# Altium schematic sheet AudioBoard.SchDoc
size A4; SheetNumber: 1; SheetTotal: 1
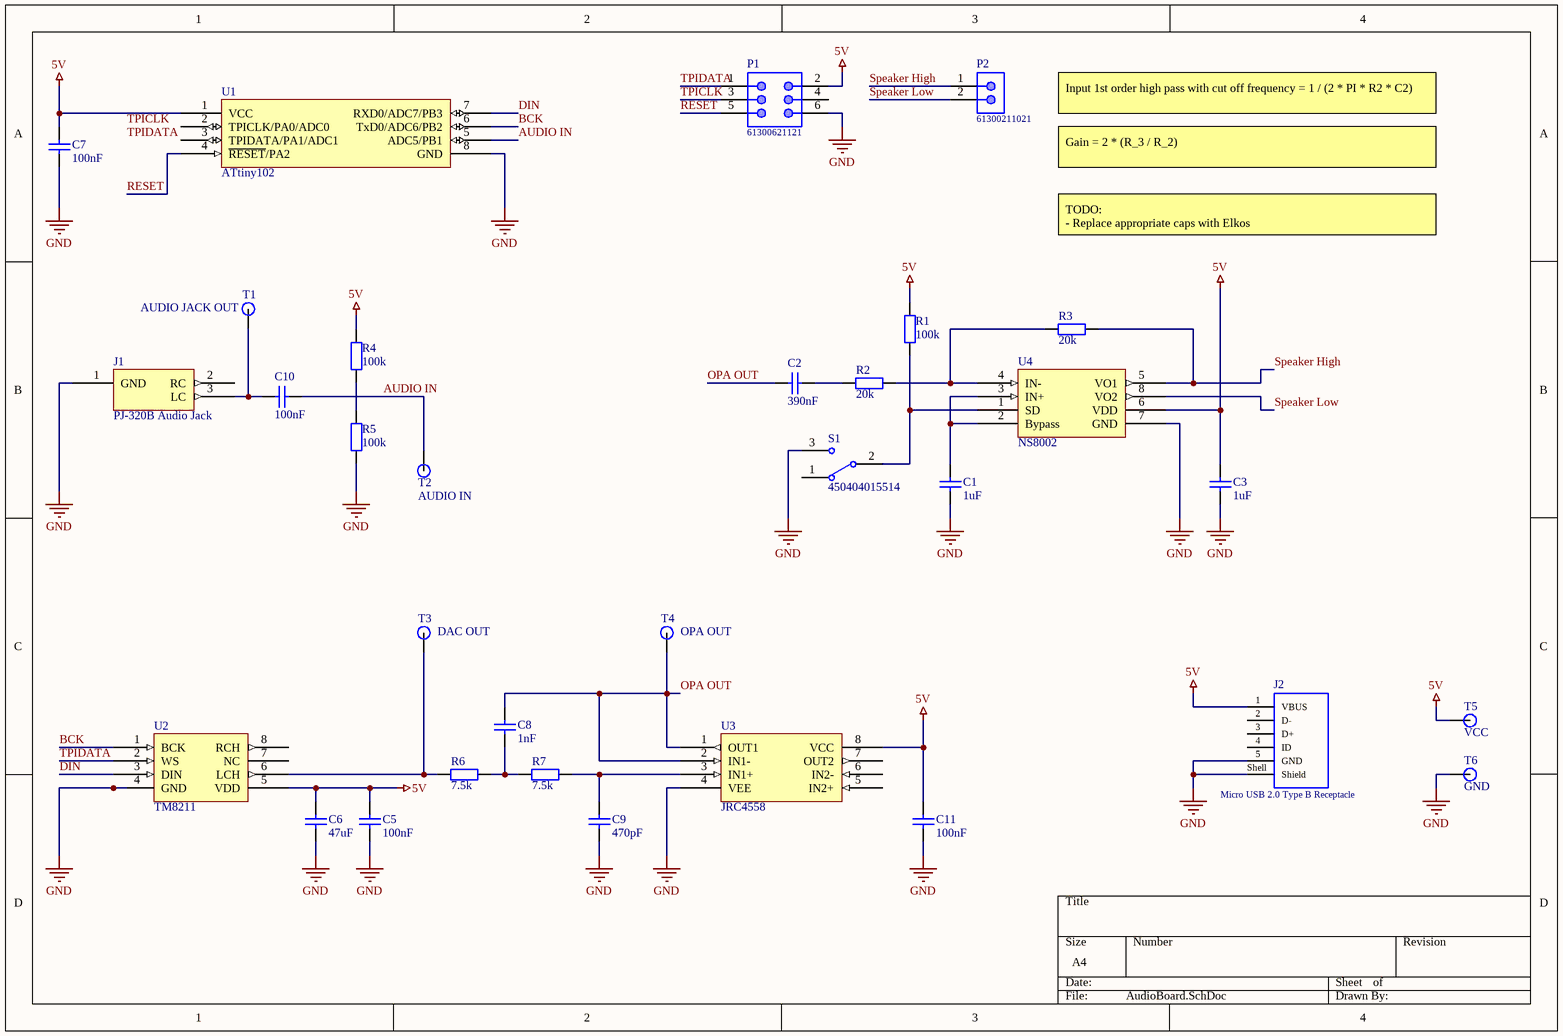
[diagram p0: AudioBoard.SchDoc]

## Parts
C1  1uF  [WCAP-CSGP_0805_H=1.25mm]
C2  390nF  [WCAP-CSGP_0402]
C3  1uF  [WCAP-CSGP_0805_H=1.25mm]
C5  100nF  [WCAP-CSGP_0805_H=1.25mm]
C6  47uF  [WCAP-CSGP_0805_H=1.25mm]
C7  100nF  [WCAP-CSGP_0805_H=1.25mm]
C8  1nF  [WCAP-CSGP_0402]
C9  470pF  [WCAP-CSGP_0402]
C10  100nF  [WCAP-CSGP_0805_H=1.25mm]
C11  100nF  [WCAP-CSGP_0805_H=1.25mm]
J1  PJ-320B Audio Jack  [PJ-320B Audio Jack]
J2  Micro USB 2.0 Type B Receptacle  [629105136821]
P1  61300621121  [61300621121]
P2  61300211021  [61300211021]
R1  100k  [WRIS-PSMB_0805_H=0.22mm]
R2  20k  [0402 Resistor]
R3  20k  [0402 Resistor]
R4  100k  [WRIS-PSMB_0805_H=0.22mm]
R5  100k  [WRIS-PSMB_0805_H=0.22mm]
R6  7.5k  [WRIS-PSMB_0805_H=0.22mm]
R7  7.5k  [WRIS-PSMB_0805_H=0.22mm]
S1  450404015514  [450404015514]
T1  AUDIO JACK OUT  [Testpoint]
T2  AUDIO IN  [Testpoint]
T3  DAC OUT  [Testpoint]
T4  OPA OUT  [Testpoint]
T5  VCC  [Testpoint]
T6  GND  [Testpoint]
U1  ATtiny102  [ATtiny102]
U2  TM8211  [TM8211]
U3  JRC4558  [JRC4558]
U4  NS8002  [NS8002]

## Nets
5V: C3.1 C5.1 C6.1 C7.1 C11.1 J2.1(VBUS) P1.2 R1.2 R4.1 T5.1 U1.1(VCC) U2.5(VDD) U3.8(VCC) U4.6(VDD)
GND: C1.1 C3.2 C5.2 C6.2 C7.2 C9.1 C11.2 J1.1(GND) J2.5(GND) J2.Shell(Shield) P1.6 R5.2 S1.3 T6.1 U1.8(GND) U2.4(GND) U3.4(VEE) U4.7(GND)
AUDIO IN: C10.2 T2.1 U1.5(ADC5/PB1)
BCK: U1.6(TxD0/ADC6/PB2) U2.1(BCK)
DIN: U1.7(RXD0/ADC7/PB3) U2.3(DIN)
OPA OUT: C2.2 C8.2 T4.1 U3.1(OUT1) U3.2(IN1-)
RESET: P1.5 U1.4(~{RESET}/PA2)
Speaker High: P2.1 R3.2 U4.5(VO1)
Speaker Low: P2.2 U4.8(VO2)
TPICLK: P1.3
TPIDATA: P1.1 U2.2(WS)
NetC1_2: C1.2 U4.2(Bypass) U4.3(IN+)
NetC2_1: C2.1 R2.1
NetC8_1: C8.1 R6.2 R7.1
NetC9_2: C9.2 R7.2 U3.3(IN1+)
NetC10_1: C10.1 J1.3(LC) T1.1
NetR1_1: R1.1 S1.2(COM) U4.1(SD)
NetR2_2: R2.2 R3.1 U4.4(IN-)
NetR4_2: R4.2 R5.1
NetR6_1: R6.1 T3.1 U2.6(LCH)

Not connected (* = marked no-connect by the designer): J1 2(RC); J2 2(D-) 3(D+) 4(ID); P1 4; S1 1; U1 2(TPICLK/PA0/ADC0) 3(TPIDATA/PA1/ADC1); U2 7(NC) 8(RCH); U3 5(IN2+) 6(IN2-) 7(OUT2)

## Notes on the sheet
- Input 1st order high pass with cut off frequency = 1 / (2 * PI * R2 * C2)
- Gain = 2 * (R_3 / R_2)
- TODO:
  - Replace appropriate caps with Elkos
  - Add Switch to connect SD to GND
- Labels drawn without touching a wire or pin: TPICLK, TPIDATA

## Library data of the parts
C1 C3 C5-C7 C10 C11 = 885012207022: WCAP-CSGP General Purpose Ceramic Capacitors, size 0805, 1uF, +/-10%, 10VDC; Isolation Resistance: >=0.5GOhm; Ceramic Type: X7R; Technical Reference: X7R0805105K010DFCT10000; ComponentLink1Description: Manufacturer; ComponentLink1URL: http://www.we-online.de; ComponentLink2Description: Datasheet; ComponentLink2URL: https://katalog.we-online.com/pbs/datasheet/885012207022.pdf; Operating Temperature: -55 to +125degC; Packaging: Tape and Reel; Part Number: 885012207022; Publisher: Wurth Elektronik; Rated Voltage: 10VDC; Published Date: August 2019; Capacitance Tolerance: +/-10%; Dissipation Factor: =<5%; Height: 1.25mm +/-0.10mm; Mounting Technology: SMD; Size: 0805; Capacitance: 1uF
C2 C8 C9 = 885012205025: WCAP-CSGP General Purpose Ceramic Capacitors, size 0402, 1nF, +/-10%, 16VDC; Isolation Resistance: >=10GOhm; Ceramic Type: X7R; Technical Reference: X7R0402102K016DFCT10000; ComponentLink1Description: Manufacturer; ComponentLink1URL: http://www.we-online.de; ComponentLink2Description: Datasheet; ComponentLink2URL: https://katalog.we-online.com/pbs/datasheet/885012205025.pdf; Operating Temperature: -55 to +125degC; Packaging: Tape and Reel; Part Number: 885012205025; Publisher: Wurth Elektronik; Rated Voltage: 16VDC; Published Date: August 2019; Capacitance Tolerance: +/-10%; Dissipation Factor: =<3.5%; Height: 0.5mm +/-0.05mm; Mounting Technology: SMD; Size: 0402; Capacitance: 1nF
J2 = 629105136821: Micro USB 2.0 Type B, Receptacle, Horizontal, SMT; Manufacturer: Wurth Elektronik; Rated Current: 1A; Pin Number: 5; Interface Type: Type B; Working Voltage: 30VAC; ComponentLink1Description: Manufacturer; ComponentLink1URL: http://www.we-online.de; ComponentLink2Description: Datasheet; ComponentLink2URL: https://katalog.we-online.com/em/datasheet/629105136821.pdf; Published Date: August 2020; Manufacturer Part Number: 629105136821; Gender: Receptacle; Type: Horizontal; Packaging: Tape and Reel; Operating Temperature: -40 to +105degC; Mounting Technology: SMT; Application: Micro USB 2.0
P1 = 61300621121: WR-PHD Pin Header, THT, pitch 2.54mm, Dual Row, Vertical, 6p; Manufacturer: Wurth Elektronik; Pin Number: 6; Rated Current: 3A; Working Voltage: 250VAC; Withstanding Voltage: 500VAC; Contact Resistance: 20mOhm; ComponentLink1Description: Manufacturer; ComponentLink1URL: http://www.we-online.de; ComponentLink2Description: Datasheet; ComponentLink2URL: https://www.we-online.com/catalog/datasheet/61300621121.pdf; Manufacturer Part Number: 61300621121; Published Date: May 2020; Pitch: 2.54mm; Operating Temperature: -40 to +105degC; Mounting Technology: THT; Packaging: Bag; Gender: Pin Header; Row Number: Dual; Orientation: Vertical
P2 = 61300211021: WR-PHD Pin Header, THT, pitch 2.54mm, Single Row, Angled, 2p; Manufacturer: Wurth Elektronik; Pin Number: 2; Rated Current: 3A; Working Voltage: 250VAC; Withstanding Voltage: 500VAC; Contact Resistance: 20mOhm; ComponentLink1Description: Manufacturer; ComponentLink1URL: http://www.we-online.de; ComponentLink2Description: Datasheet; ComponentLink2URL: https://www.we-online.com/catalog/datasheet/61300211021.pdf; Manufacturer Part Number: 61300211021; Published Date: May 2020; Pitch: 2.54mm; Operating Temperature: -40 to +105degC; Mounting Technology: THT; Packaging: Bag; Gender: Pin Header; Row Number: Single; Orientation: Angled
R1 R4-R7 = 580060720008: WRIS-PSMB Metal Plate Resistors, size 0805, 10mOhm, +/-1%, 0.5W; Rated Current: 7.07A; Temperature Coefficient of Resistance: +/-100ppm/degC; Technical Reference: MB0805R010F102KAATP0000; ComponentLink1Description: Manufacturer; ComponentLink1URL: http://www.we-online.de; ComponentLink2Description: Datasheet; ComponentLink2URL: https://katalog.we-online.com/pbs/datasheet/580060720008.pdf; Publisher: Wurth Elektronik; Rated Power: 0.5W; Resistance: 10mOhm; Mounting Technology: SMT; Height: 0.22mm; Part Number: 580060720008; Packaging: Tape and Reel; Published Date: September 2019; Size: 0805; Length: 2mm; Operating Temperature: -55 to +155degC; Resistance Tolerance: +/-1%; Width: 1.25mm
R2 R3 = Resistor: CRG0402 1% 2K0; MF: {'manufacturer': u'TE Connectivity'}; MP: 4-1676480-2; Availability: Unavailable; Value: *; Package: None; Price: None
S1 = 450404015514: WS-SLSU Mini SMT Slide Switch, Same Side Connection, Right Angled, SPDT; Rated Current: 300mA; Rated Voltage: 5VDC; Switching Function: On-On; ComponentLink1Description: Manufacturer; ComponentLink1URL: http://www.we-online.de; ComponentLink2Description: Datasheet; ComponentLink2URL: https://katalog.we-online.com/em/datasheet/450404015514.pdf; Packaging: Tape and Reel; Publisher: Wurth Elektronik; Contact Material: Copper Alloy; Mounting Technology: SMT; Operating Temperature: -40 to +85degC; Contact Plating: Silver; Part Number: 450404015514; Published Date: September 2019; Terminal Material: Copper Alloy; Size: 6.7x2.7mm; Circuit: SPDT; Terminal Plating: Silver
T1-T6 = Testpoint